# Altium schematic sheet Alimentation.SchDoc: Alimentation
size A4; ApprovedBy: Baptiste GADEBILLE; CheckedBy: Baptiste GADEBILLE; Author: Baptiste GADEBILLE; DrawnBy: Baptiste GADEBILLE; Revision: V1.0 Rev A; SheetNumber: 2; SheetTotal: 5
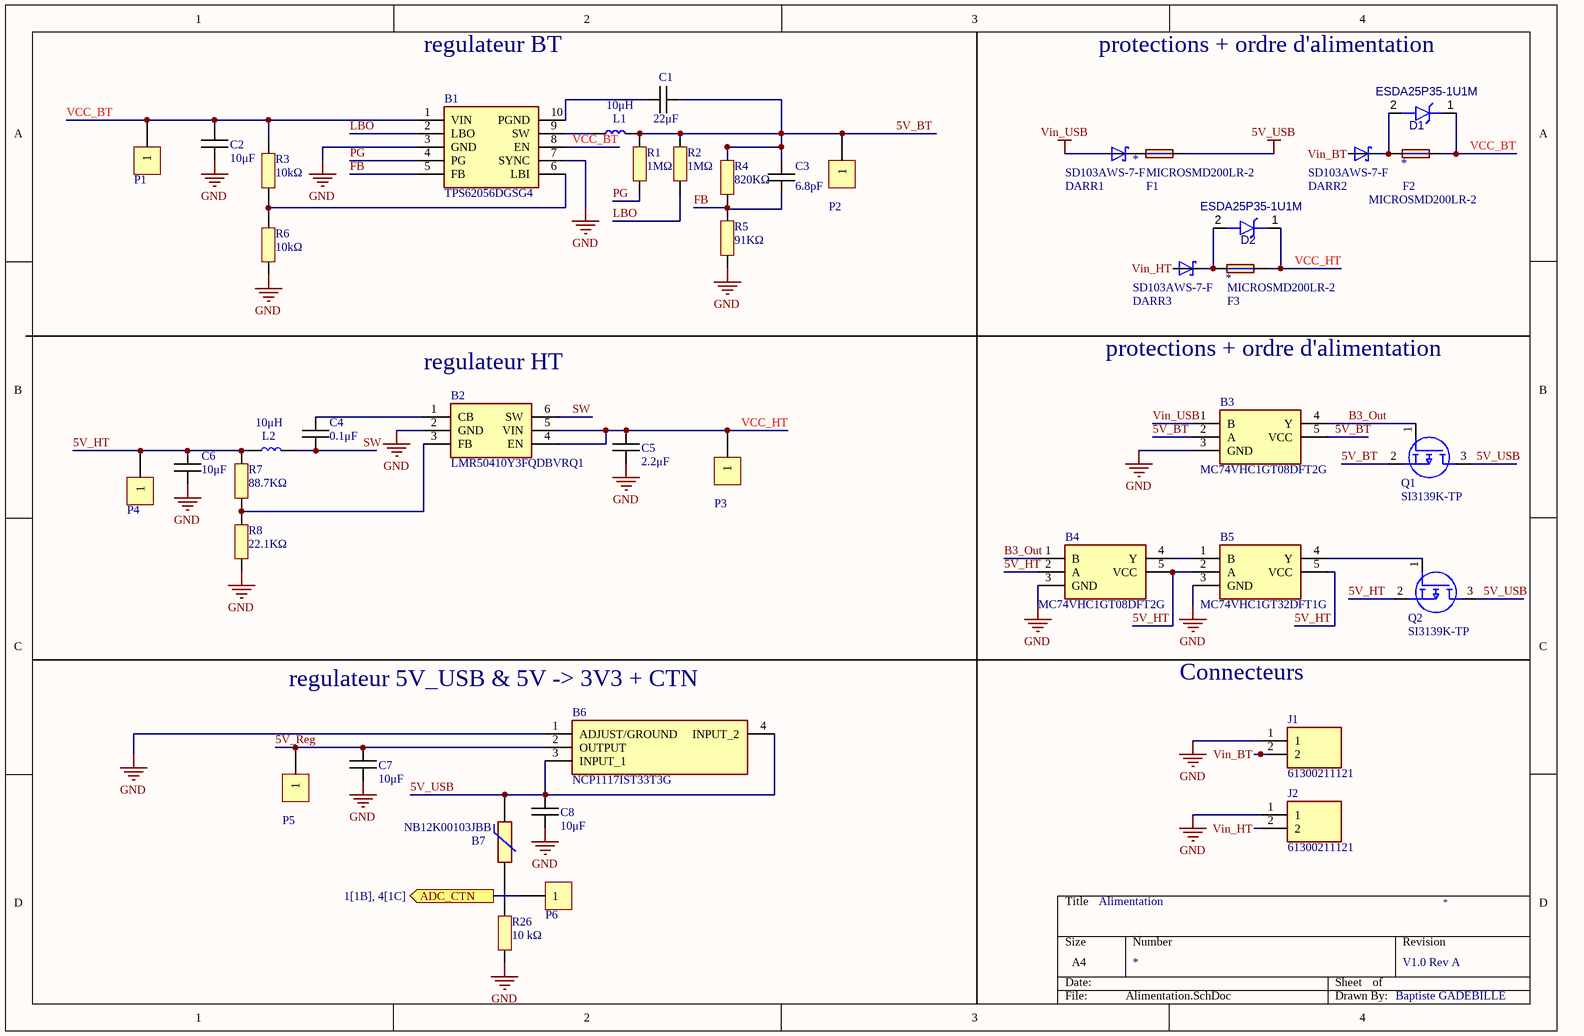
[diagram p0: Alimentation.SchDoc]

## Parts
B1  TPS62056DGSG4  [SOP50P490X110-10N]
B2  LMR50410Y3FQDBVRQ1  [SOT95P280X145-6N]
B3  MC74VHC1GT08DFT2G  [SOT65P210X110-5N]
B4  MC74VHC1GT08DFT2G  [SOT65P210X110-5N]
B5  MC74VHC1GT32DFT1G  [SOT65P210X110-5N]
B6  NCP1117IST33T3G  [SOT230P700X180-4N]
B7  NB12K00103JBB  [RESC2212X50N]
C1  22μF  [CAPC1005X06N]
C2  10μF  [CAPC1005X06N]
C3  6.8pF  [CAPC1005X06N]
C4  0.1μF  [CAPC1005X06N]
C5  2.2μF  [CAPC1005X06N]
C6  10μF  [CAPC1005X06N]
C7  10μF  [CAPC1005X06N]
C8  10μF  [CAPC1005X06N]
D1  ESDA25P35-1U1M  [STM-QFN1610]
D2  ESDA25P35-1U1M  [STM-QFN1610]
DARR1  SD103AWS-7-F  [SD103AWS-7-F]
DARR2  SD103AWS-7-F  [SD103AWS-7-F]
DARR3  SD103AWS-7-F  [SD103AWS-7-F]
F1  MICROSMD200LR-2  [FUSC3225X100N]
F2  MICROSMD200LR-2  [FUSC3225X100N]
F3  MICROSMD200LR-2  [FUSC3225X100N]
J1  61300211121  [61300211121]
J2  61300211121  [61300211121]
L1  10μH  [LQPC1005X06N]
L2  10μH  [LQPC1005X06N]
P1  Plage CMS 10x5  [Plage CMS 10x5]  (value not drawn)  (no BOM)
P2  Plage CMS 10x5  [Plage CMS 10x5]  (value not drawn)  (no BOM)
P3  Plage CMS 10x5  [Plage CMS 10x5]  (value not drawn)  (no BOM)
P4  Plage CMS 10x5  [Plage CMS 10x5]  (value not drawn)  (no BOM)
P5  Plage CMS 10x5  [Plage CMS 10x5]  (value not drawn)  (no BOM)
P6  Plage CMS 10x5  [Plage CMS 10x5]  (value not drawn)  (no BOM)
Q1  SI3139K-TP  [SI3139K-TP]
Q2  SI3139K-TP  [SI3139K-TP]
R1  1MΩ  [RESC1005X06N]
R2  1MΩ  [RESC1005X06N]
R3  10kΩ  [RESC1005X06N]
R4  820KΩ  [RESC1005X06N]
R5  91KΩ  [RESC1005X06N]
R6  10kΩ  [RESC1005X06N]
R7  88.7KΩ  [RESC1005X06N]
R8  22.1KΩ  [RESC1005X06N]
R26  10 kΩ  [RESC1005X06N]

## Ports
ADC_CTN (out, see 1[1B], 4[1C])

## Nets
5V_USB: B6.3(INPUT_1) B6.4(INPUT_2) B7.1 C8.1 F1.2 Q1.3(D) Q2.3(D)
GND: B1.3(GND) B1.7(SYNC) B2.2(GND) B3.3(GND) B4.3(GND) B5.3(GND) B6.1(ADJUST/GROUND) C2.2 C5.2 C6.2 C7.2 C8.2 J1.1 J2.1 R5.2 R6.2 R8.2 R26.2
Vin_USB: B3.1(B) DARR1.2(A)
5V_BT: B3.2(A) B3.5(VCC) C1.2 C3.2 L1.2 P2.1 Q1.2(S) R1.1 R2.1 R4.1
5V_HT: B4.2(A) B4.5(VCC) B5.2(A) B5.5(VCC) C6.1 L2.1 P4.1 Q2.2(S) R7.1
5V_Reg: B6.2(OUTPUT) C7.1 P5.1
ADC_CTN: P6.1 ; port ADC_CTN
B3_Out: B3.4(Y) B4.1(B) Q1.1(G)
FB: B1.5(FB) C3.1 R4.2 R5.1
LBO: B1.2(LBO) R2.2
PG: B1.4(PG) R1.2
SW: B2.6(SW) C4.2 L2.2
VCC_BT: B1.1(VIN) B1.8(EN) C2.1 D1.1(A) F2.2 P1.1 R3.1
VCC_HT: B2.4(EN) B2.5(VIN) C5.1 D2.1(A) F3.2 P3.1
Vin_BT: DARR2.2(A) J1.2
Vin_HT: DARR3.2(A) J2.2
NetB1_6: B1.6(LBI) R3.2 R6.1
NetB1_9: B1.9(SW) L1.1
NetB1_10: B1.10(PGND) C1.1
NetB2_1: B2.1(CB) C4.1
NetB2_3: B2.3(FB) R7.2 R8.1
NetB4_4: B4.4(Y) B5.1(B)
NetB5_4: B5.4(Y) Q2.1(G)
NetB7_2: B7.2 R26.1
NetD1_2: D1.2(A) DARR2.1(C) F2.1
NetD2_2: D2.2(A) DARR3.1(C) F3.1
NetDARR1_1: DARR1.1(C) F1.1

## Notes on the sheet
- regulateur BT
- protections + ordre d'alimentation
- (near B2) regulateur HT
- (near B6) regulateur 5V_USB & 5V -> 3V3 + CTN
- Connecteurs

## Library data of the parts
B1 = TPS62056DGSG4: TEXAS INSTRUMENTS - TPS62056DGSG4 - Synchronous Buck (Step Down) Switching Regulator, Fixed, 2.7V-10Vin, 3.3V/0.8A out, 850kHz, VSSOP-10; Manufacturer_Name: Texas Instruments; Manufacturer_Part_Number: TPS62056DGSG4; Mouser Part Number: 595-TPS62056DGSG4
B2 = LMR50410Y3FQDBVRQ1: Régulateurs de tension de commutation Automotive qualified SIMPLE SWITCHER 4-V to 36-V, 1-A synchronous step-down converter 6-SOT-23 -40 to 150; Manufacturer_Name: Texas Instruments; Manufacturer_Part_Number: LMR50410Y3FQDBVRQ1; Mouser Part Number: 595-R50410Y3FQDBVRQ1
B3 B4 = MC74VHC1GT08DFT2G: Single 2-Input AND Gate, TTL Level; Manufacturer_Name: onsemi; Manufacturer_Part_Number: MC74VHC1GT08DFT2G; Parameter 3: *
B5 = MC74VHC1GT32DFT1G: Single 2-Input OR Gate, TTL Level; Manufacturer_Name: onsemi; Manufacturer_Part_Number: MC74VHC1GT32DFT1G; Mouser Part Number: 863-C74VHC1GT32DFT1G
B6 = NCP1117IST33T3G: Linear Voltage Regulator IC Positive Fixed 1 Output 1A SOT-223; Parameter 1: onsemi; Parameter 3: 863-NCP1117IST33T3G; Parameter 2: NCP1117IST33T3G
B7 = NB12K00103JBB: NTC SMD Thermistor, NB12K, 10K, 5% AVX 10k 0805 Protection NTC Thermistor, 5s, 2 x 1.25 x 1.3mm; Manufacturer_Name: Kyocera AVX; Geometry.Height: 0.5mm; Manufacturer_Part_Number: NB12K00103JBB; Mouser Part Number: 581-NB12K00103JBB; Mouser Price/Stock: https://www.mouser.co.uk/ProductDetail/AVX/NB12K00103JBB/?qs=4%252B6%252BTdINQeDPvI%252BQUQjJ3Q%3D%3D; Arrow Part Number: NB12K00103JBB; Arrow Price/Stock: https://www.arrow.com/en/products/nb12k00103jbb/avx; Datasheet Link: https://datasheet.datasheetarchive.com/originals/distributors/Datasheets-DGA6/551314.pdf
C1-C8 = Capacitor
D1 D2 = CMP-004-00023-3: TVS DIODE 22V 41V 1610; Peak Inverse Voltage: 23.3V; Max Surge Current: 35A; Mounting Technology: SMT; Case/Package: QFN1610 (0603); RoHS Compliant: Yes; Pins: 2
DARR1-DARR3 = SD103AWS-7-F: Diode Array 3 Independent Schottky 40V 175mA Surface Mount 6-TSSOP, SC-88, SOT-363
F1-F3 = CMP-011-000001-1: Polymeric PTC Resettable Fuse 6V 2A Ih Surface Mount 1210 _3225 Metric_, Concave; MF: Littelfuse Inc.; Package: 1210 TE Connectivity; Design Item ID: MICROSMD200LR-2; Source: SnapEDAsch.SchLib; Value: *; Pin Count: 2; SnapEDA_Link: https://www.snapeda.com/parts/MICROSMD200LR-2/Littelfuse%20Inc./view-part/2874530/?ref=snap; Price: None; Component Type: Standard; MP: MICROSMD200LR-2; Availability: Unavailable
J1 J2 = 61300211121: WURTH ELEKTRONIK - 61300211121 - HEADER, 2.54MM, PIN, THT, VERTICAL, 2WAY
L1 L2 = Bobine
P1-P6 = Plage CMS 10x5: Plage de report CMS 10x5mm; PN: L30; Value: Plage CMS 10x5; Footprint_statut: ok
Q1 Q2 = SI3139K-TP: MOSFET P-Channel MOSFET
R1-R8 R26 = Resistor